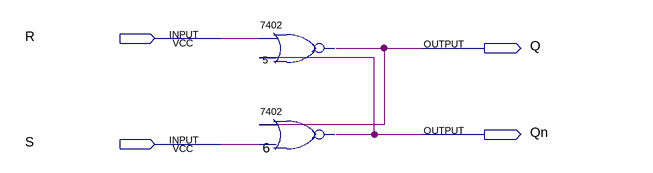
[diagram p0: schematic sheet]
// Quartus schematic Problem1.bdf as structural Verilog: 2 symbols, 4 pins
module Problem1 (
  input  R,
  input  S,
  output Q,
  output Qn
);

  \7402  u_5 (.\2 (R), .\3 (Qn), .\1 (Q));
  \7402  u_6 (.\2 (Q), .\3 (S), .\1 (Qn));
endmodule
